# EAGLE design controle detc (EAGLE 7.4.0)
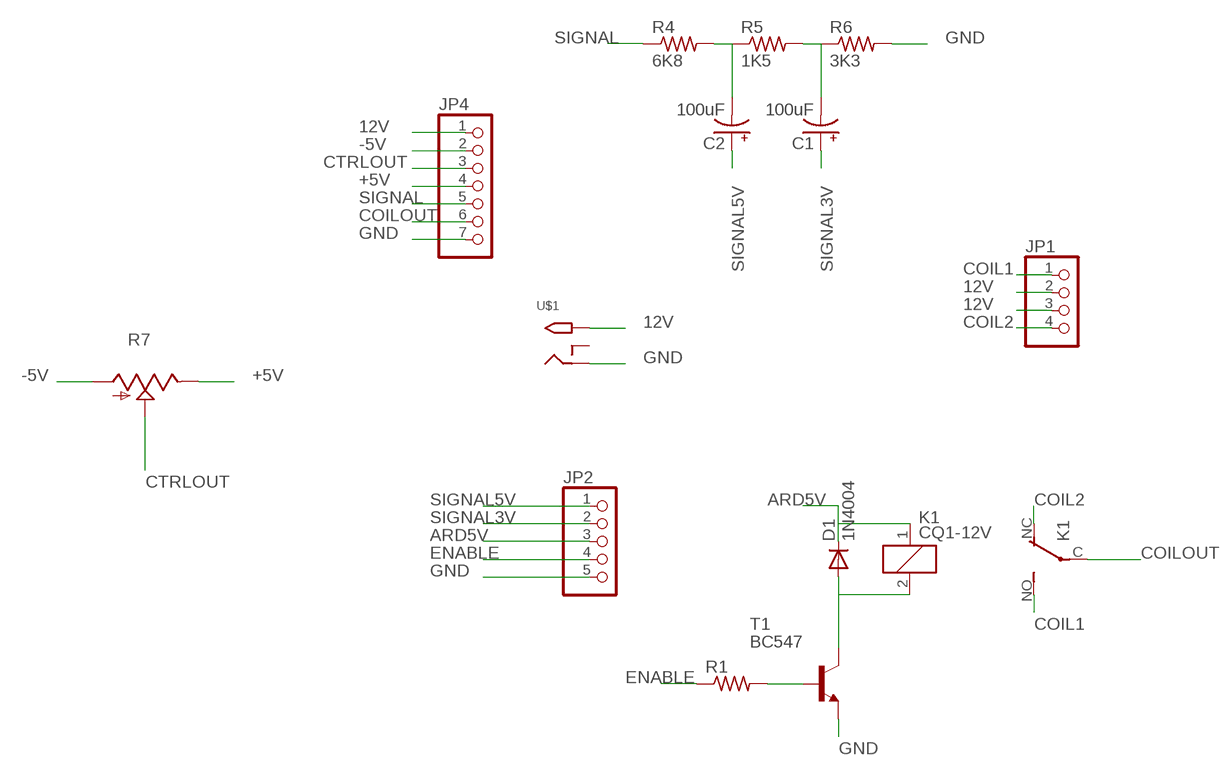
[diagram p0: schematic, sheet 1]

## Parts
C1  100uF  CPOL-USE5-8.5  [E5-8,5]
C2  100uF  CPOL-USE5-8.5  [E5-8,5]
D1  1N4004  [DO41-10]
JP1  PINHD-1X4  [1X04]
JP2  PINHD-1X5  [1X05]
JP4  PINHD-1X7  [1X07]
K1  CQ1-12V  [CQ1]
R1  R-US_0207/7  [0207/7]
R4  6K8  R-US_0207/7  [0207/7]
R5  1K5  R-US_0207/7  [0207/7]
R6  3K3  R-US_0207/7  [0207/7]
R7  TRIM_US-S64W  [S64W]
T1  BC547  [TO92]
U$1  2.1MMJACKTHM  [PJ-102A]

## Nets
12V: JP1.2 JP1.3 JP4.1 U$1.TIP
+5V: JP4.4 R7.E
-5V: JP4.2 R7.A
ARD5V: D1.C JP2.3 K1.1
COIL1: JP1.1 K1.NO(2:S)
COIL2: JP1.4 K1.NC(2:O)
COILOUT: JP4.6 K1.C(2:P)
CTRLOUT: JP4.3 R7.S
ENABLE: JP2.4 R1.1
GND: JP2.5 JP4.7 R6.2 T1.1(E) U$1.RING
N$1: R1.2 T1.2(B)
N$2: D1.A K1.2 T1.3(C)
N$3: C2.- R4.2 R5.1
N$4: C1.- R5.2 R6.1
SIGNAL: JP4.5 R4.1
SIGNAL3V: C1.+ JP2.2
SIGNAL5V: C2.+ JP2.1
Unconnected: U$1.RING_SW

## Library data of the parts
C1 C2 = adafruit:CPOL-US: POLARIZED CAPACITOR, American symbol
D1 = adafruit:1N4004: DIODE General purpose 1N400x type rectifier (With bigger pads) http://www.ladyada.net/library/pcb/eaglelibrary.html
JP1 = pinhead:PINHD-1X4: PIN HEADER
JP2 = pinhead:PINHD-1X5: PIN HEADER
JP4 = pinhead:PINHD-1X7: PIN HEADER
K1 = relay:CQ1-12V: AUTOMOTIVE QUIET RELAY NAiS Source: http://www.mew-europe.com/.. en_ds_61208_0000.pdf; OC_FARNELL: unknown; OC_NEWARK: unknown
R1 R4-R6 = adafruit:R-US_: RESISTOR, American symbol
R7 = pot:TRIM_US-: POTENTIOMETER
T1 = transistor:BC547: NPN TRANSISTOR
U$1 = adafruit:2.1MMJACK: 2.1mm x 5.5mm THM DC jack with internal switch. Digikey part #PJ-102A, 4UCON part #05537 2.1mm x 5.5mm SMT DC jack with internal switch. Digikey part #PJ-002A-SMT, 4UCON part #03267 By microbuilder.eu & adafruit.com

## Board
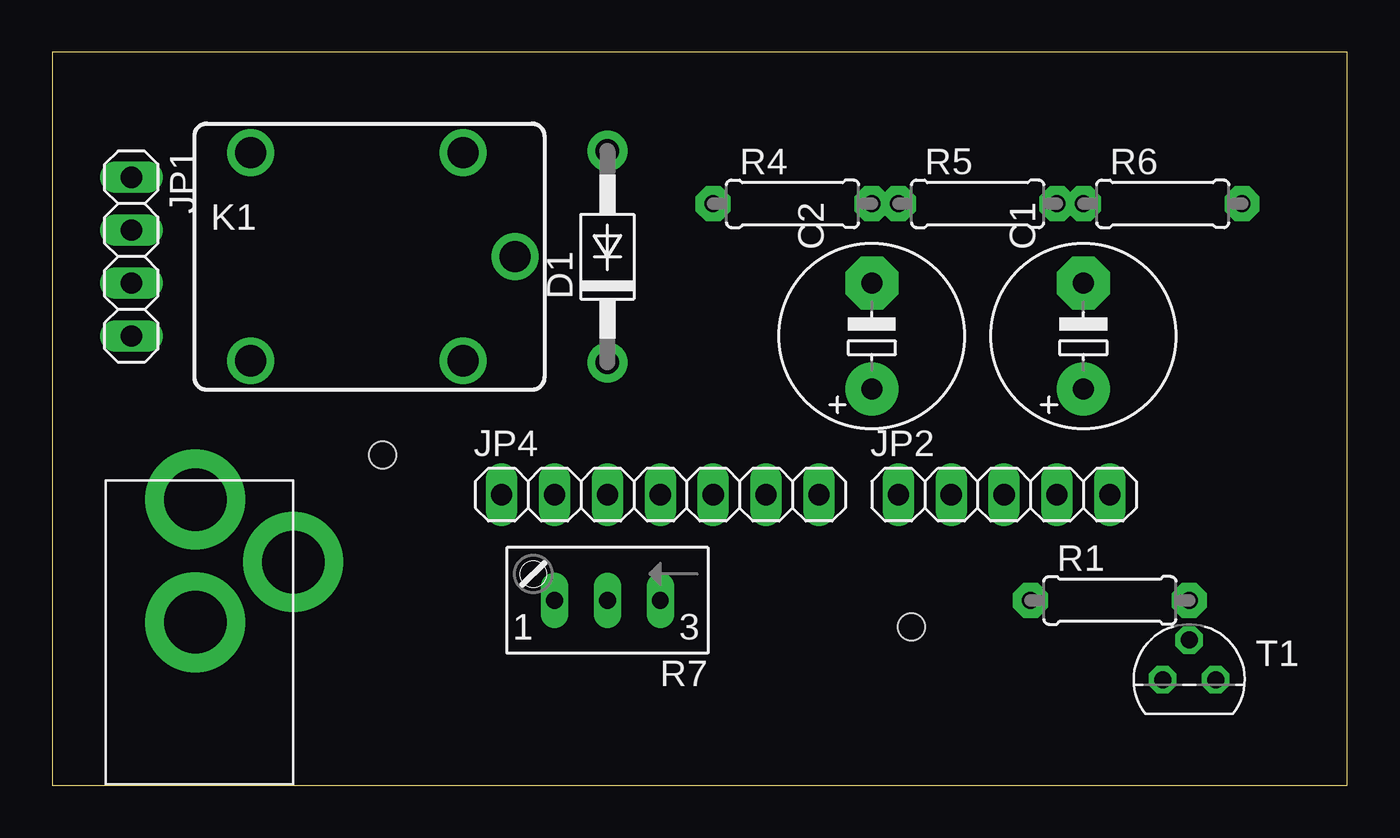
[diagram p1: board, top side]
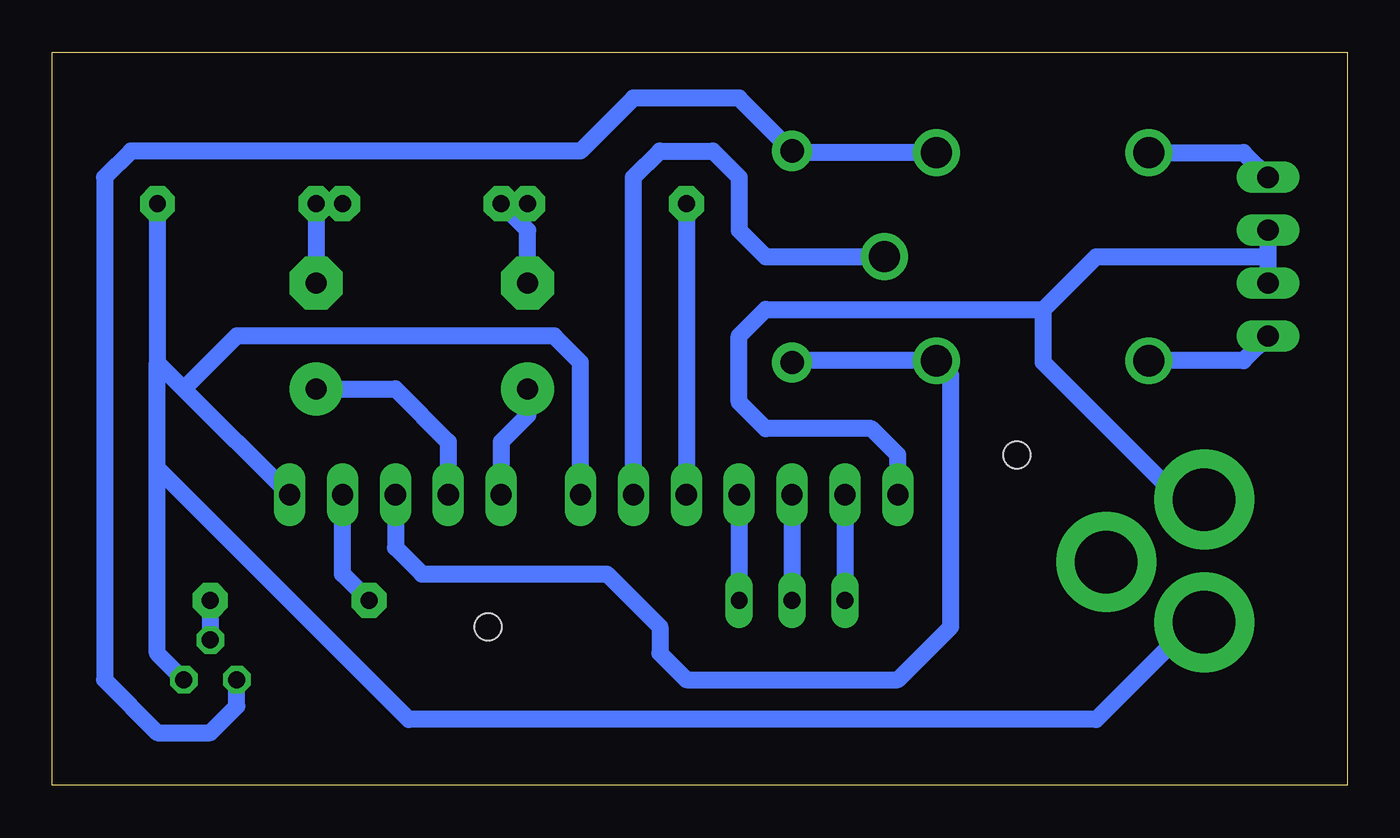
[diagram p2: board, bottom side, seen from below]

Size 62.21 x 35.23 mm. Coordinates in mm from the lower left corner, seen from the top.
Outline: 0,0 62.21,0 62.21,35.23 0,35.23 0,0
Copper layers (1*16): Top 0.035mm / dielectric 1.5mm / Bottom 0.035mm
Design rules "default": minimum track width 10mil, minimum drill 24mil, track to track 8mil, track to pad 8mil, pad to pad 8mil, via to via 8mil, smd to smd 8mil, copper to edge 40mil, drill to drill 8mil, minimum pad ring 10mil, minimum via ring 8mil, stop-mask expansion 4mil, vias tented up to drill 0mil, thermal gap 10mil
Holes 1.3 mm at 15.87,15.88 41.27,7.62

### Footprints (pad centres in the part's own frame; a part is rotated, then mirrored left to right if it is on the bottom)
E5-8,5 = drill 1.016 pad 2.54: + -2.54,0 | drill 1.016 pad 2.54 octagon: - 2.54,0
DO41-10 = drill 1.118 pad 1.93: A 5.08,0; C -5.08,0
1X04 = drill 1.016 long: 1 -3.81,0; 2 -1.27,0; 3 1.27,0; 4 3.81,0
1X05 = drill 1.016 long: 1 -5.08,0; 2 -2.54,0; 3 0,0; 4 2.54,0; 5 5.08,0
1X07 = drill 1.016 long: 1 -7.62,0; 2 -5.08,0; 3 -2.54,0; 4 0,0; 5 2.54,0; 6 5.08,0; 7 7.62,0
CQ1 = drill 1.5: 1 4.5,-5; 2 4.5,5; C 7,0; NC -5.7,-5; NO -5.7,5
0207/7 = drill 0.813 pad 1.676 octagon: 1 -3.81,0; 2 3.81,0
S64W = drill 0.813 long: A 2.54,1.27; E -2.54,1.27; S 0,1.27
TO92 = drill 0.813 octagon: 1 1.27,0; 2 0,1.905; 3 -1.27,0
PJ-102A = drill 3 pad 4.8: RING 0.1,-3.39; RING_SW -4.6,-6.29; TIP 0.1,-9.29

### Placement (x,y rotation side)
C1  49.53,21.59 90 top
C2  39.37,21.59 90 top
D1  26.67,25.4 90 top
JP1  3.81,25.4 270 top
JP2  45.72,13.97 0 top
JP4  29.21,13.97 0 top
K1  15.24,25.4 0 top
R1  50.8,8.89 0 top
R4  35.56,27.94 0 top
R5  44.45,27.94 0 top
R6  53.34,27.94 0 top
R7  26.67,10.16 180 top
T1  54.61,5.08 0 top
U$1  6.98,4.45 180 top

### Tracks (layer width: path | path; a pad name or v marks a point on that pad's centre or on a via)
12V
  Bottom 0.813: JP1.3 3.81,25.4 | 3.81,25.4 JP1.2 | JP4.1 21.59,15.88 22.86,17.15 27.94,17.15 29.21,18.41 29.21,21.59 27.94,22.86 14.6,22.86 | 14.6,22.86 12.07,25.4 3.81,25.4 | U$1.TIP 8.02,13.73 14.6,20.32 14.6,22.86
+5V
  Bottom 0.813: JP4.4 R7.E
-5V
  Bottom 0.813: JP4.2 R7.A
ARD5V
  Bottom 0.813: JP2.3 45.72,11.43 44.45,10.16 35.56,10.16 33.02,7.62 33.02,6.35 31.75,5.08 21.59,5.08 19.05,7.62 19.05,19.71 K1.1 26.59,20.4 D1.C
COIL1
  Bottom 0.813: K1.NO 5,30.4 JP1.1
COIL2
  Bottom 0.813: JP1.4 5,20.4 K1.NC
COILOUT
  Bottom 0.813: K1.C 27.94,25.4 29.21,26.67 29.21,29.21 30.48,30.48 33.02,30.48 34.29,29.21 JP4.6
CTRLOUT
  Bottom 0.813: JP4.3 R7.S
ENABLE
  Bottom 0.813: R1.1 48.26,10.16 JP2.4
GND
  Bottom 0.813: R6.2 57.15,20.32 | 57.15,20.32 55.88,19.05 | 55.88,19.05 53.34,21.59 38.1,21.59 36.83,20.32 JP4.7 | JP2.5 55.88,19.05 | 57.15,15.24 57.15,6.35 T1.1 | 57.15,15.24 57.15,20.32 | U$1.RING 7.4,7.84 12.07,3.17 45.09,3.17 57.15,15.24
N$1
  Bottom 0.813: R1.2 T1.2
N$2
  Bottom 0.813: K1.2 26.59,30.4 D1.A 29.21,33.02 34.29,33.02 36.83,30.48 58.42,30.48 59.69,29.21 59.69,5.08 57.15,2.54 54.61,2.54 53.34,3.81 T1.3
N$3
  Bottom 0.813: R4.2 R5.1 39.37,26.67 C2.-
N$4
  Bottom 0.813: R5.2 R6.1 C1.-
SIGNAL
  Bottom 0.813: R4.1 JP4.5
SIGNAL3V
  Bottom 0.813: C1.+ 45.72,19.05 43.18,16.51 JP2.2
SIGNAL5V
  Bottom 0.813: C2.+ 39.37,17.78 40.64,16.51 JP2.1